# Altium schematic sheet Part06_DIP.SchDoc
size A4
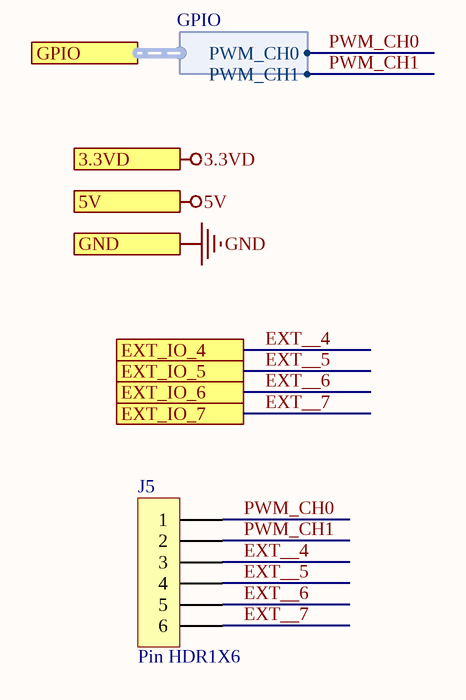
[diagram p0: Part06_DIP.SchDoc]

## Parts
J5  Pin HDR1X6  [Pin HDR1X6/2.54mm-S]

## Ports
3.3VD, 5V, EXT_IO_4, EXT_IO_5, EXT_IO_6, EXT_IO_7, GND, GPIO (harness GPIO)

## Harnesses
GPIO: PWM_CH0, PWM_CH1

## Nets
3.3VD: port 3.3VD
5V: port 5V
GND: port GND
EXT__4: J5.3 ; port EXT_IO_4
EXT__5: J5.4 ; port EXT_IO_5
EXT__6: J5.5 ; port EXT_IO_6
EXT__7: J5.6 ; port EXT_IO_7
PWM_CH0: J5.1 ; port GPIO.PWM_CH0
PWM_CH1: J5.2 ; port GPIO.PWM_CH1